# Altium schematic sheet QCLogic Rev B Sht2 MCU Power.SchDoc
size A4
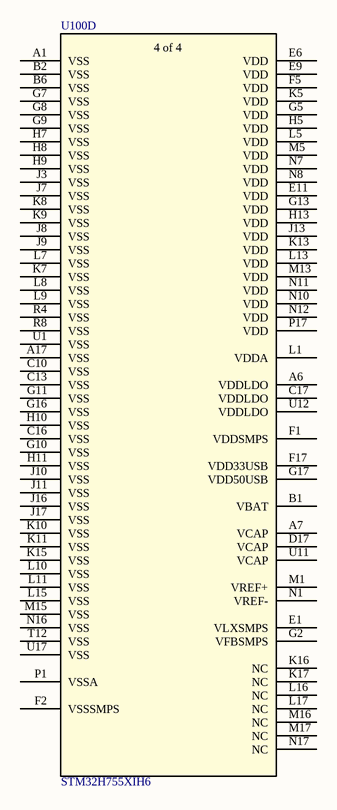
[diagram p0: QCLogic Rev B Sht2 MCU Power.SchDoc]

## Parts
U100  STM32H755XIH6  [TFBGA240+25]  (part D of 4)

## Nets

Not connected (* = marked no-connect by the designer): U100 A1(VSS) A6(VDDLDO) A7(VCAP) A17(VSS) B1(VBAT) B2(VSS) B6(VSS) C10(VSS) C13(VSS) C16(VSS) C17(VDDLDO) D17(VCAP) E1(VLXSMPS) E6(VDD) E9(VDD) E11(VDD) F1(VDDSMPS) F2(VSSSMPS) F5(VDD) F17(VDD33USB) G2(VFBSMPS) G5(VDD) G7(VSS) G8(VSS) G9(VSS) G10(VSS) G11(VSS) G13(VDD) G16(VSS) G17(VDD50USB) H5(VDD) H7(VSS) H8(VSS) H9(VSS) H10(VSS) H11(VSS) H13(VDD) J3(VSS) J7(VSS) J8(VSS) J9(VSS) J10(VSS) J11(VSS) J13(VDD) J16(VSS) J17(VSS) K5(VDD) K7(VSS) K8(VSS) K9(VSS) K10(VSS) K11(VSS) K13(VDD) K15(VSS) K16(NC) K17(NC) L1(VDDA) L5(VDD) L7(VSS) L8(VSS) L9(VSS) L10(VSS) L11(VSS) L13(VDD) L15(VSS) L16(NC) L17(NC) M1(VREF+) M5(VDD) M13(VDD) M15(VSS) M16(NC) M17(NC) N1(VREF-) N7(VDD) N8(VDD) N10(VDD) N11(VDD) N12(VDD) N16(VSS) N17(NC) P1(VSSA) P17(VDD) R4(VSS) R8(VSS) T12(VSS) U1(VSS) U11(VCAP) U12(VDDLDO) U17(VSS)

## Notes on the sheet
- (in symbol IC MCU 32BIT 2MB FLASH TFBGA, part D) 4 of 4

## Library data of the parts
U100 = IC MCU 32BIT 2MB FLASH TFBGA: 1. Manufacturer: STMicroelectronics; 2. Manufacturer Part Number: STM32H755XIH6; 3. Date Modified: 20201206; 4. Footprint: TFBGA240+25